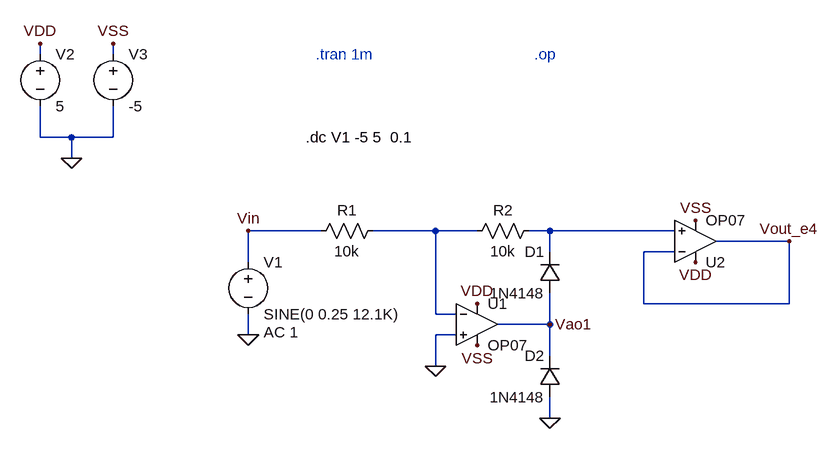
[diagram p0: schematic etajul4.asc]
etajul4.asc, the LTspice schematic file:
Version 4
SHEET 1 1632 692
WIRE -608 -272 -608 -288
WIRE -496 -272 -496 -288
WIRE -608 -144 -608 -192
WIRE -560 -144 -608 -144
WIRE -496 -144 -496 -192
WIRE -496 -144 -560 -144
WIRE -560 -112 -560 -144
WIRE -176 0 -288 0
WIRE 0 0 -96 0
WIRE 64 0 0 0
WIRE 176 0 144 0
WIRE 368 0 176 0
WIRE 544 16 432 16
WIRE 176 32 176 0
WIRE 368 32 320 32
WIRE -288 48 -288 0
WIRE 320 112 320 32
WIRE 544 112 544 16
WIRE 544 112 320 112
WIRE 0 128 0 0
WIRE 32 128 0 128
WIRE 176 144 176 96
WIRE 176 144 96 144
WIRE -288 160 -288 128
WIRE 32 160 0 160
WIRE 176 192 176 144
WIRE 0 208 0 160
WIRE 176 288 176 256
FLAG 0 208 0
FLAG 176 288 0
FLAG -288 160 0
FLAG -608 -288 VDD
FLAG -496 -288 VSS
FLAG -560 -112 0
FLAG -288 0 Vin
FLAG 544 16 Vout_e4
FLAG 400 48 VDD
FLAG 400 -16 VSS
FLAG 64 176 VSS
FLAG 64 112 VDD
FLAG 176 144 Vao1
SYMBOL OpAmps\\OP07 64 80 R0
SYMATTR InstName U1
SYMBOL res -80 -16 R90
WINDOW 0 0 56 VBottom 2
WINDOW 3 32 56 VTop 2
SYMATTR InstName R1
SYMATTR Value 10k
SYMBOL res 160 -16 R90
WINDOW 0 0 56 VBottom 2
WINDOW 3 32 56 VTop 2
SYMATTR InstName R2
SYMATTR Value 10k
SYMBOL diode 192 96 R180
WINDOW 0 24 64 Left 2
WINDOW 3 24 0 Left 2
SYMATTR InstName D1
SYMATTR Value 1N4148
SYMBOL diode 192 256 R180
WINDOW 0 24 64 Left 2
WINDOW 3 24 0 Left 2
SYMATTR InstName D2
SYMATTR Value 1N4148
SYMBOL voltage -288 32 R0
WINDOW 123 24 124 Left 2
WINDOW 39 0 0 Left 0
SYMATTR Value2 AC 1
SYMATTR InstName V1
SYMATTR Value SINE(0 0.25 12.1K)
SYMBOL voltage -608 -288 R0
WINDOW 123 0 0 Left 0
WINDOW 39 0 0 Left 0
SYMATTR InstName V2
SYMATTR Value 5
SYMBOL voltage -496 -288 R0
WINDOW 123 0 0 Left 0
WINDOW 39 0 0 Left 0
SYMATTR InstName V3
SYMATTR Value -5
SYMBOL OpAmps\\OP07 400 80 M180
SYMATTR InstName U2
TEXT -200 -144 Left 2 !.dc V1 -5 5  0.1
TEXT -184 -272 Left 2 ;.tran 1m
TEXT 152 -272 Left 2 ;.op

The netlist it stands for:
* etajul4.asc
XU1 0 N001 VDD VSS Vao1 LT1001  ; OP07, pins In+ In- V+ V- OUT
R1 N001 Vin 10k
R2 N002 N001 10k
D1 Vao1 N002 1N4148
D2 0 Vao1 1N4148
V1 Vin 0 SINE(0 0.25 12.1K) AC 1
V2 VDD 0 5
V3 VSS 0 -5
XU2 N002 Vout_e4 VDD VSS Vout_e4 LT1001  ; OP07, pins In+ In- V+ V- OUT
.model D D
.lib standard.dio
.dc V1 -5 5  0.1
* .tran 1m
* .op
.lib LTC.lib
.backanno
.end